# Altium schematic sheet PowerManager.SchDoc
size A
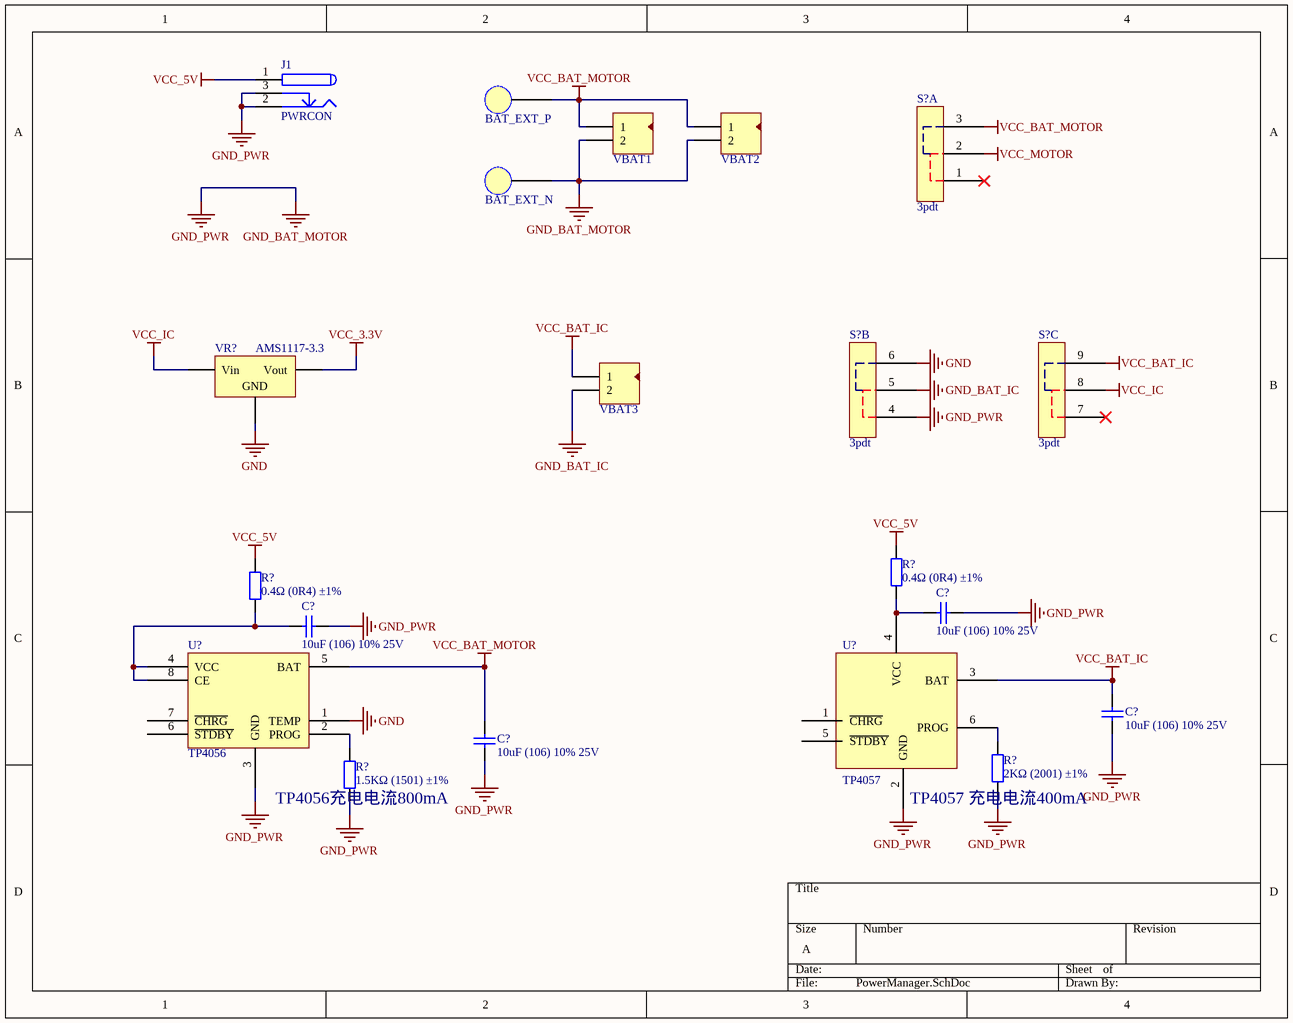
[diagram p0: PowerManager.SchDoc]

## Parts
(Parts that share a designator on the sheet are numbered #1, #2 ... from top to bottom, then left to right.)
BAT_EXT_N  Test Point  [TP]  (value not drawn)
BAT_EXT_P  Test Point  [TP]  (value not drawn)
C?#1  10uF (106) 10% 25V  [LC-0805_C]
C?#2  10uF (106) 10% 25V  [LC-0805_C]
C?#3  10uF (106) 10% 25V  [LC-0805_C]
C?#4  10uF (106) 10% 25V  [LC-0805_C]
J1  PWRCON  [DC-005]
R?#1  0.4Ω (0R4) ±1%  [LC-0805_R]
R?#2  0.4Ω (0R4) ±1%  [LC-0805_R]
R?#3  2KΩ (2001) ±1%  [LC-0402_R]
R?#4  1.5KΩ (1501) ±1%  [LC-0402_R]
S?#1  3pdt  [GF-161]  (part A of 3)
S?#2  3pdt  [GF-161]  (part B of 3)
S?#3  3pdt  [GF-161]  (part C of 3)
U?#1  TP4056  [SOP8-PP]
U?#2  TP4057  [SOT23-6]
VBAT1  Header 2  [HDR2X1-2.54]  (value not drawn)
VBAT2  Header 2  [HDR2X1-2.54]  (value not drawn)
VBAT3  Header 2  [HDR2X1-2.54]  (value not drawn)
VR?  AMS1117-3.3  [LC-SOT-223]

## Nets
GND: S?#2.6 U?#1.1(TEMP) VR?.1(GND)
GND_BAT_IC: S?#2.5 VBAT3.2
GND_BAT_MOTOR: BAT_EXT_N.1(T) C?#1.2 C?#2.2 C?#3.1 C?#4.1 J1.2 J1.3 R?#3.1 R?#4.1 S?#2.4 U?#1.3(GND) U?#2.2(GND) VBAT1.2 VBAT2.2  [also labelled GND_PWR]
VCC_3.3V: VR?.2(Vout)
VCC_5V: J1.1 R?#1.2 R?#2.2
VCC_BAT_IC: C?#3.2 S?#3.9 U?#2.3(BAT) VBAT3.1
VCC_BAT_MOTOR: BAT_EXT_P.1(T) C?#4.2 S?#1.3 U?#1.5(BAT) VBAT1.1 VBAT2.1
VCC_IC: S?#3.8 VR?.3(Vin)
VCC_MOTOR: S?#1.2
NetC?#1_1: C?#1.1 R?#1.1 U?#2.4(VCC)
NetC?#2_1: C?#2.1 R?#2.1 U?#1.4(VCC) U?#1.8(CE)
NetR?#3_2: R?#3.2 U?#2.6(PROG)
NetR?#4_2: R?#4.2 U?#1.2(PROG)

Not connected (* = marked no-connect by the designer): S?#1 1*; S?#3 7*; U?#1 6(~{STDBY}) 7(~{CHRG}); U?#2 1(~{CHRG}) 5(~{STDBY})

## Notes on the sheet
- (near R?#4) TP4056充电电流800mA
- (near R?#3) TP4057 充电电流400mA

## Library data of the parts
C?#1-C?#4 = 0805 10uF (106) 10% 25V: 贴片电容; ComponentLink1Description: 供应商链接; ComponentLink1URL: http://www.szlcsc.com/product/details_16532.html; Package: 0805; Supplier: LC; SuppliersPartNumber: C15850
J1 = PWRCON: 直流电源端子; Published: 17-Dec-2003; DatasheetDocument: 09-May-2002; Publisher: Altium Limited; ComponentLink1Description: Manufacturer Link; ComponentLink1URL: http://domino.kycon.com/internet/Products.html
R?#1 R?#2 = 0805 0Ω (0R0) 1%: 贴片电阻; ComponentLink1Description: 供应商链接; ComponentLink1URL: http://www.szlcsc.com/product/details_18165.html; Package: 0805; Supplier: LC; SuppliersPartNumber: C17477
R?#3 = 0402 2KΩ (2001) 1%: 贴片电阻; ComponentLink1Description: 供应商链接; ComponentLink1URL: http://www.szlcsc.com/product/details_4516.html; Package: 0402; Supplier: LC; SuppliersPartNumber: C4109
R?#4 = 0402 1.5KΩ (1501) 1%: 贴片电阻; ComponentLink1Description: 供应商链接; ComponentLink1URL: http://www.szlcsc.com/product/details_26610.html; Package: 0402; Supplier: LC; SuppliersPartNumber: C25867
VBAT1-VBAT3 = Header 2: 接插件; LatestRevisionDate: 17-Jul-2002; LatestRevisionNote: Re-released for DXP Platform.; Publisher: Altium Limited
VR? = SOT-223 AMS1117-3.3: 低压差线性稳压(LDO); ComponentLink1Description: 供应商链接; ComponentLink1URL: http://www.szlcsc.com/product/details_6652.html; Package: SOT-223; Supplier: LC; SuppliersPartNumber: C6186